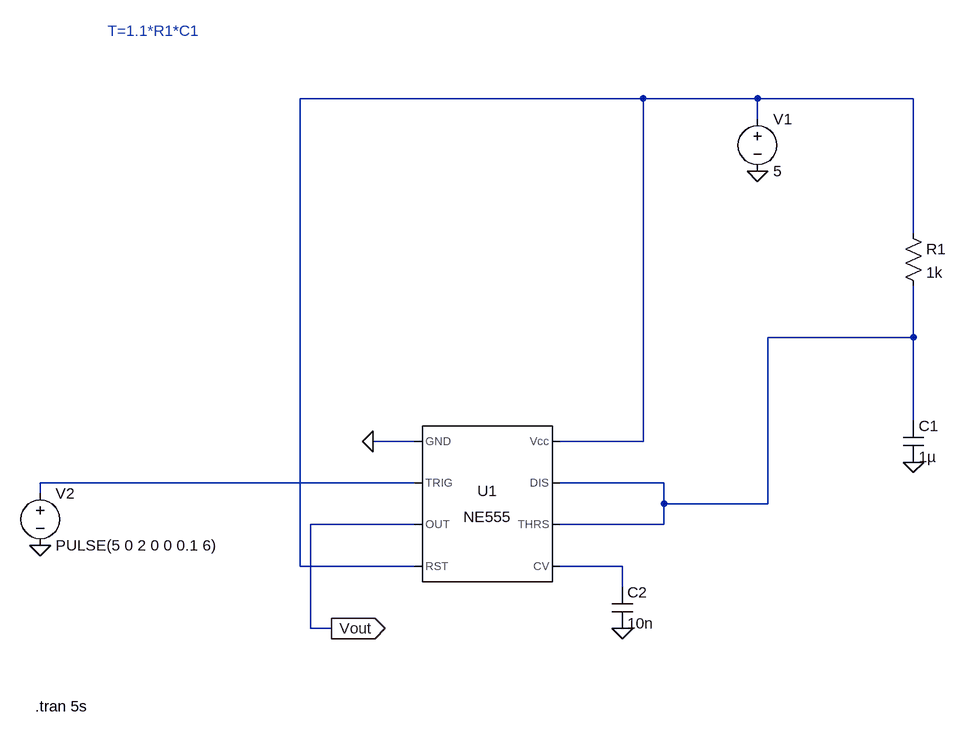
[diagram p0: schematic Ne555 Schaltung.asc]
Ne555 Schaltung.asc, the LTspice schematic file:
Version 4
SHEET 1 1208 680
WIRE 464 -480 -64 -480
WIRE 640 -480 464 -480
WIRE 880 -480 640 -480
WIRE 640 -448 640 -480
WIRE 880 -272 880 -480
WIRE 880 -112 880 -192
WIRE 880 -112 656 -112
WIRE 880 16 880 -112
WIRE 112 48 48 48
WIRE 464 48 464 -480
WIRE 464 48 336 48
WIRE 112 112 -464 112
WIRE 496 112 336 112
WIRE -464 128 -464 112
WIRE 496 144 496 112
WIRE 656 144 656 -112
WIRE 656 144 496 144
WIRE 112 176 -48 176
WIRE 496 176 496 144
WIRE 496 176 336 176
WIRE -64 240 -64 -480
WIRE 112 240 -64 240
WIRE 432 240 336 240
WIRE 432 272 432 240
WIRE -48 336 -48 176
WIRE -16 336 -48 336
FLAG 48 48 0
FLAG 640 -368 0
FLAG 880 80 0
FLAG 432 336 0
FLAG -16 336 Vout
IOPIN -16 336 Out
FLAG -464 208 0
SYMBOL Misc\\NE555 224 144 R0
SYMATTR InstName U1
SYMBOL voltage 640 -464 R0
WINDOW 123 0 0 Left 0
WINDOW 39 0 0 Left 0
SYMATTR InstName V1
SYMATTR Value 5
SYMBOL res 864 -288 R0
SYMATTR InstName R1
SYMATTR Value 1k
SYMBOL cap 864 16 R0
SYMATTR InstName C1
SYMATTR Value 1µ
SYMBOL cap 416 272 R0
SYMATTR InstName C2
SYMATTR Value 10n
SYMBOL voltage -464 112 R0
WINDOW 123 0 0 Left 0
WINDOW 39 0 0 Left 0
SYMATTR InstName V2
SYMATTR Value PULSE(5 0 2 0 0 0.1 6)
TEXT -472 456 Left 2 !.tran 5s
TEXT -360 -584 Left 2 ;T=1.1*R1*C1

The netlist it stands for:
* Ne555 Schaltung.asc
XU1 0 N003 Vout N001 N004 N002 N002 N001 NE555  ; pins GND TRIG OUT RST CV THRS DIS Vcc
V1 N001 0 5
R1 N001 N002 1k
C1 N002 0 1µ
C2 N004 0 10n
V2 N003 0 PULSE(5 0 2 0 0 0.1 6)
.tran 5s
* T=1.1*R1*C1
.lib NE555.sub
.backanno
.end